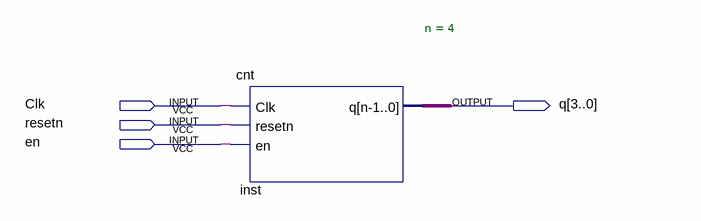
[diagram p0: schematic sheet]
// Quartus schematic MSI_VHDL.bdf as structural Verilog: 1 symbols, 4 pins
module MSI_VHDL (
  input  Clk,
  input  resetn,
  input  en,
  output [3:0] q
);

  cnt #(.n(4)) inst (.Clk(Clk), .resetn(resetn), .en(en), .q(q));
endmodule
